# EasyEDA Pro project easyeda_project.epro, schematic SingleAcquisition

## Sheets
1 Signal Conditioning: Board Name: Acquisition; Create Date: 2024-08-09; Page Name: Signal Conditioning; Project Name: Thermal Flow Acquisition; Schematic Name: SingleAcquisition; Update Date: 2025-02-12; Company: EasyEDA.com; Drawn: EasyEDA; Page Size: A4; Part Number: JLCPCB-002; Reviewed: EasyEDA; Version: V0.1
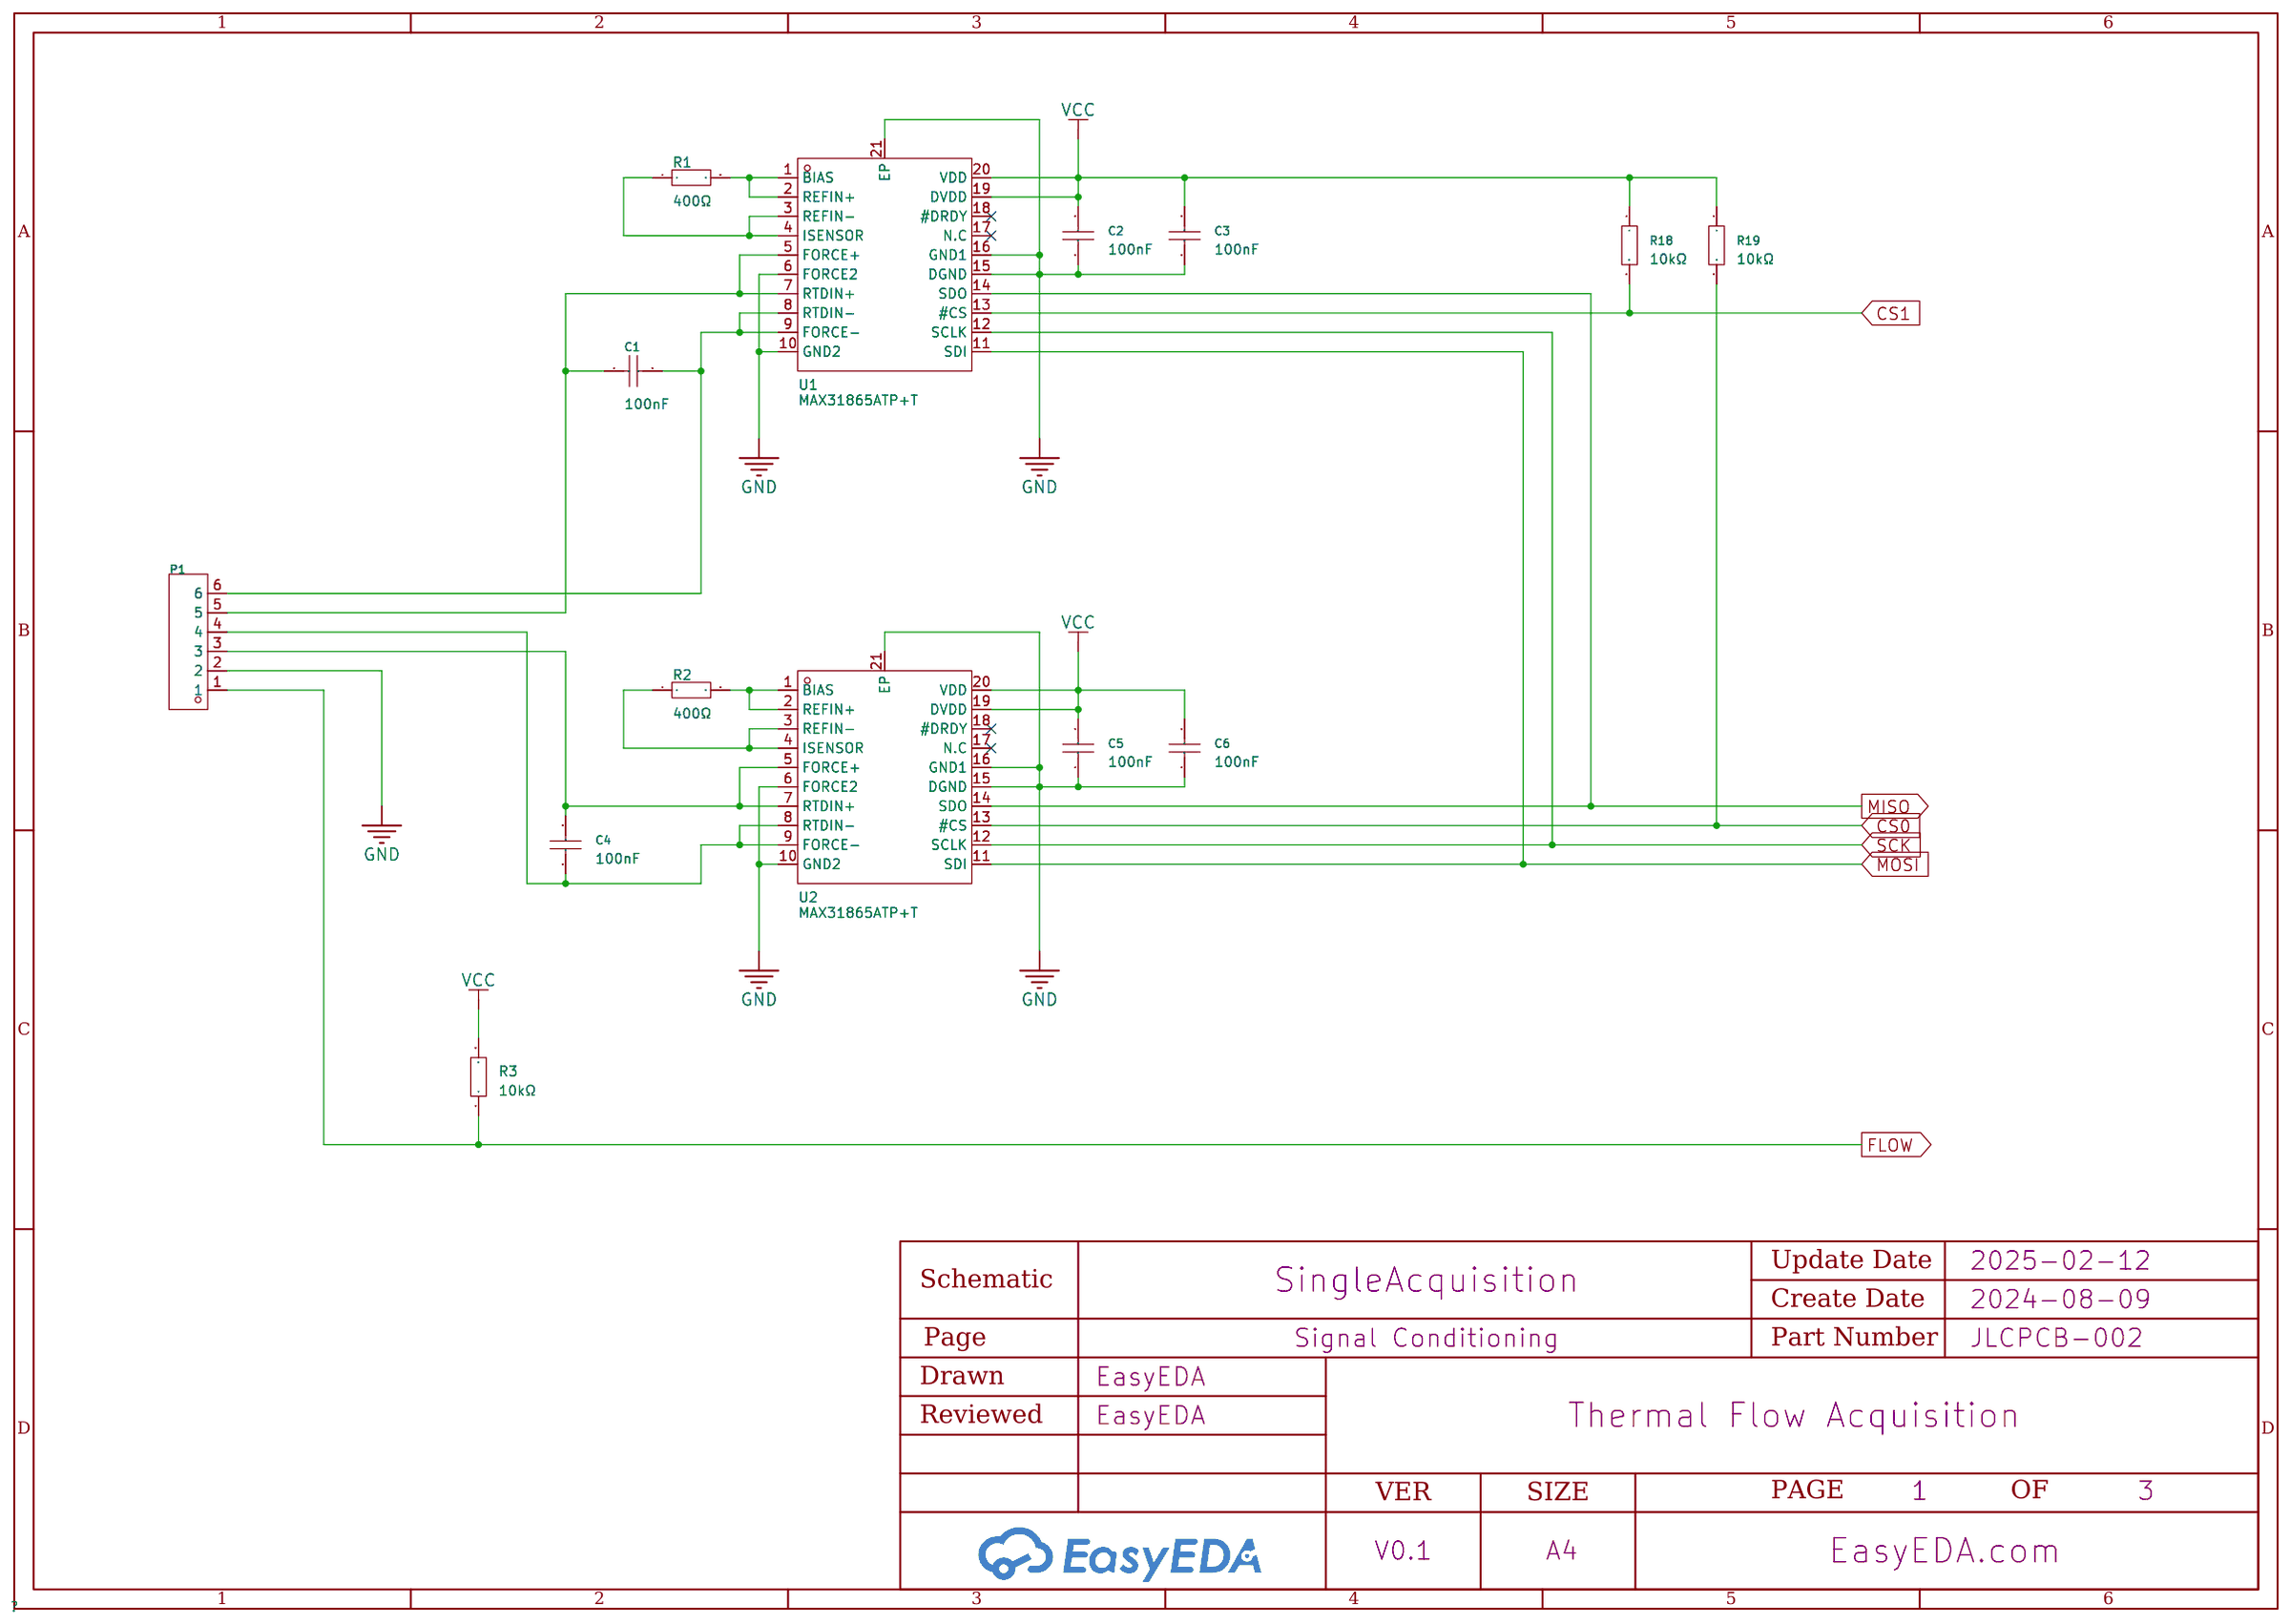
[diagram p0: Signal Conditioning]
2 MCU: Page Name: MCU; Update Date: 2025-03-19
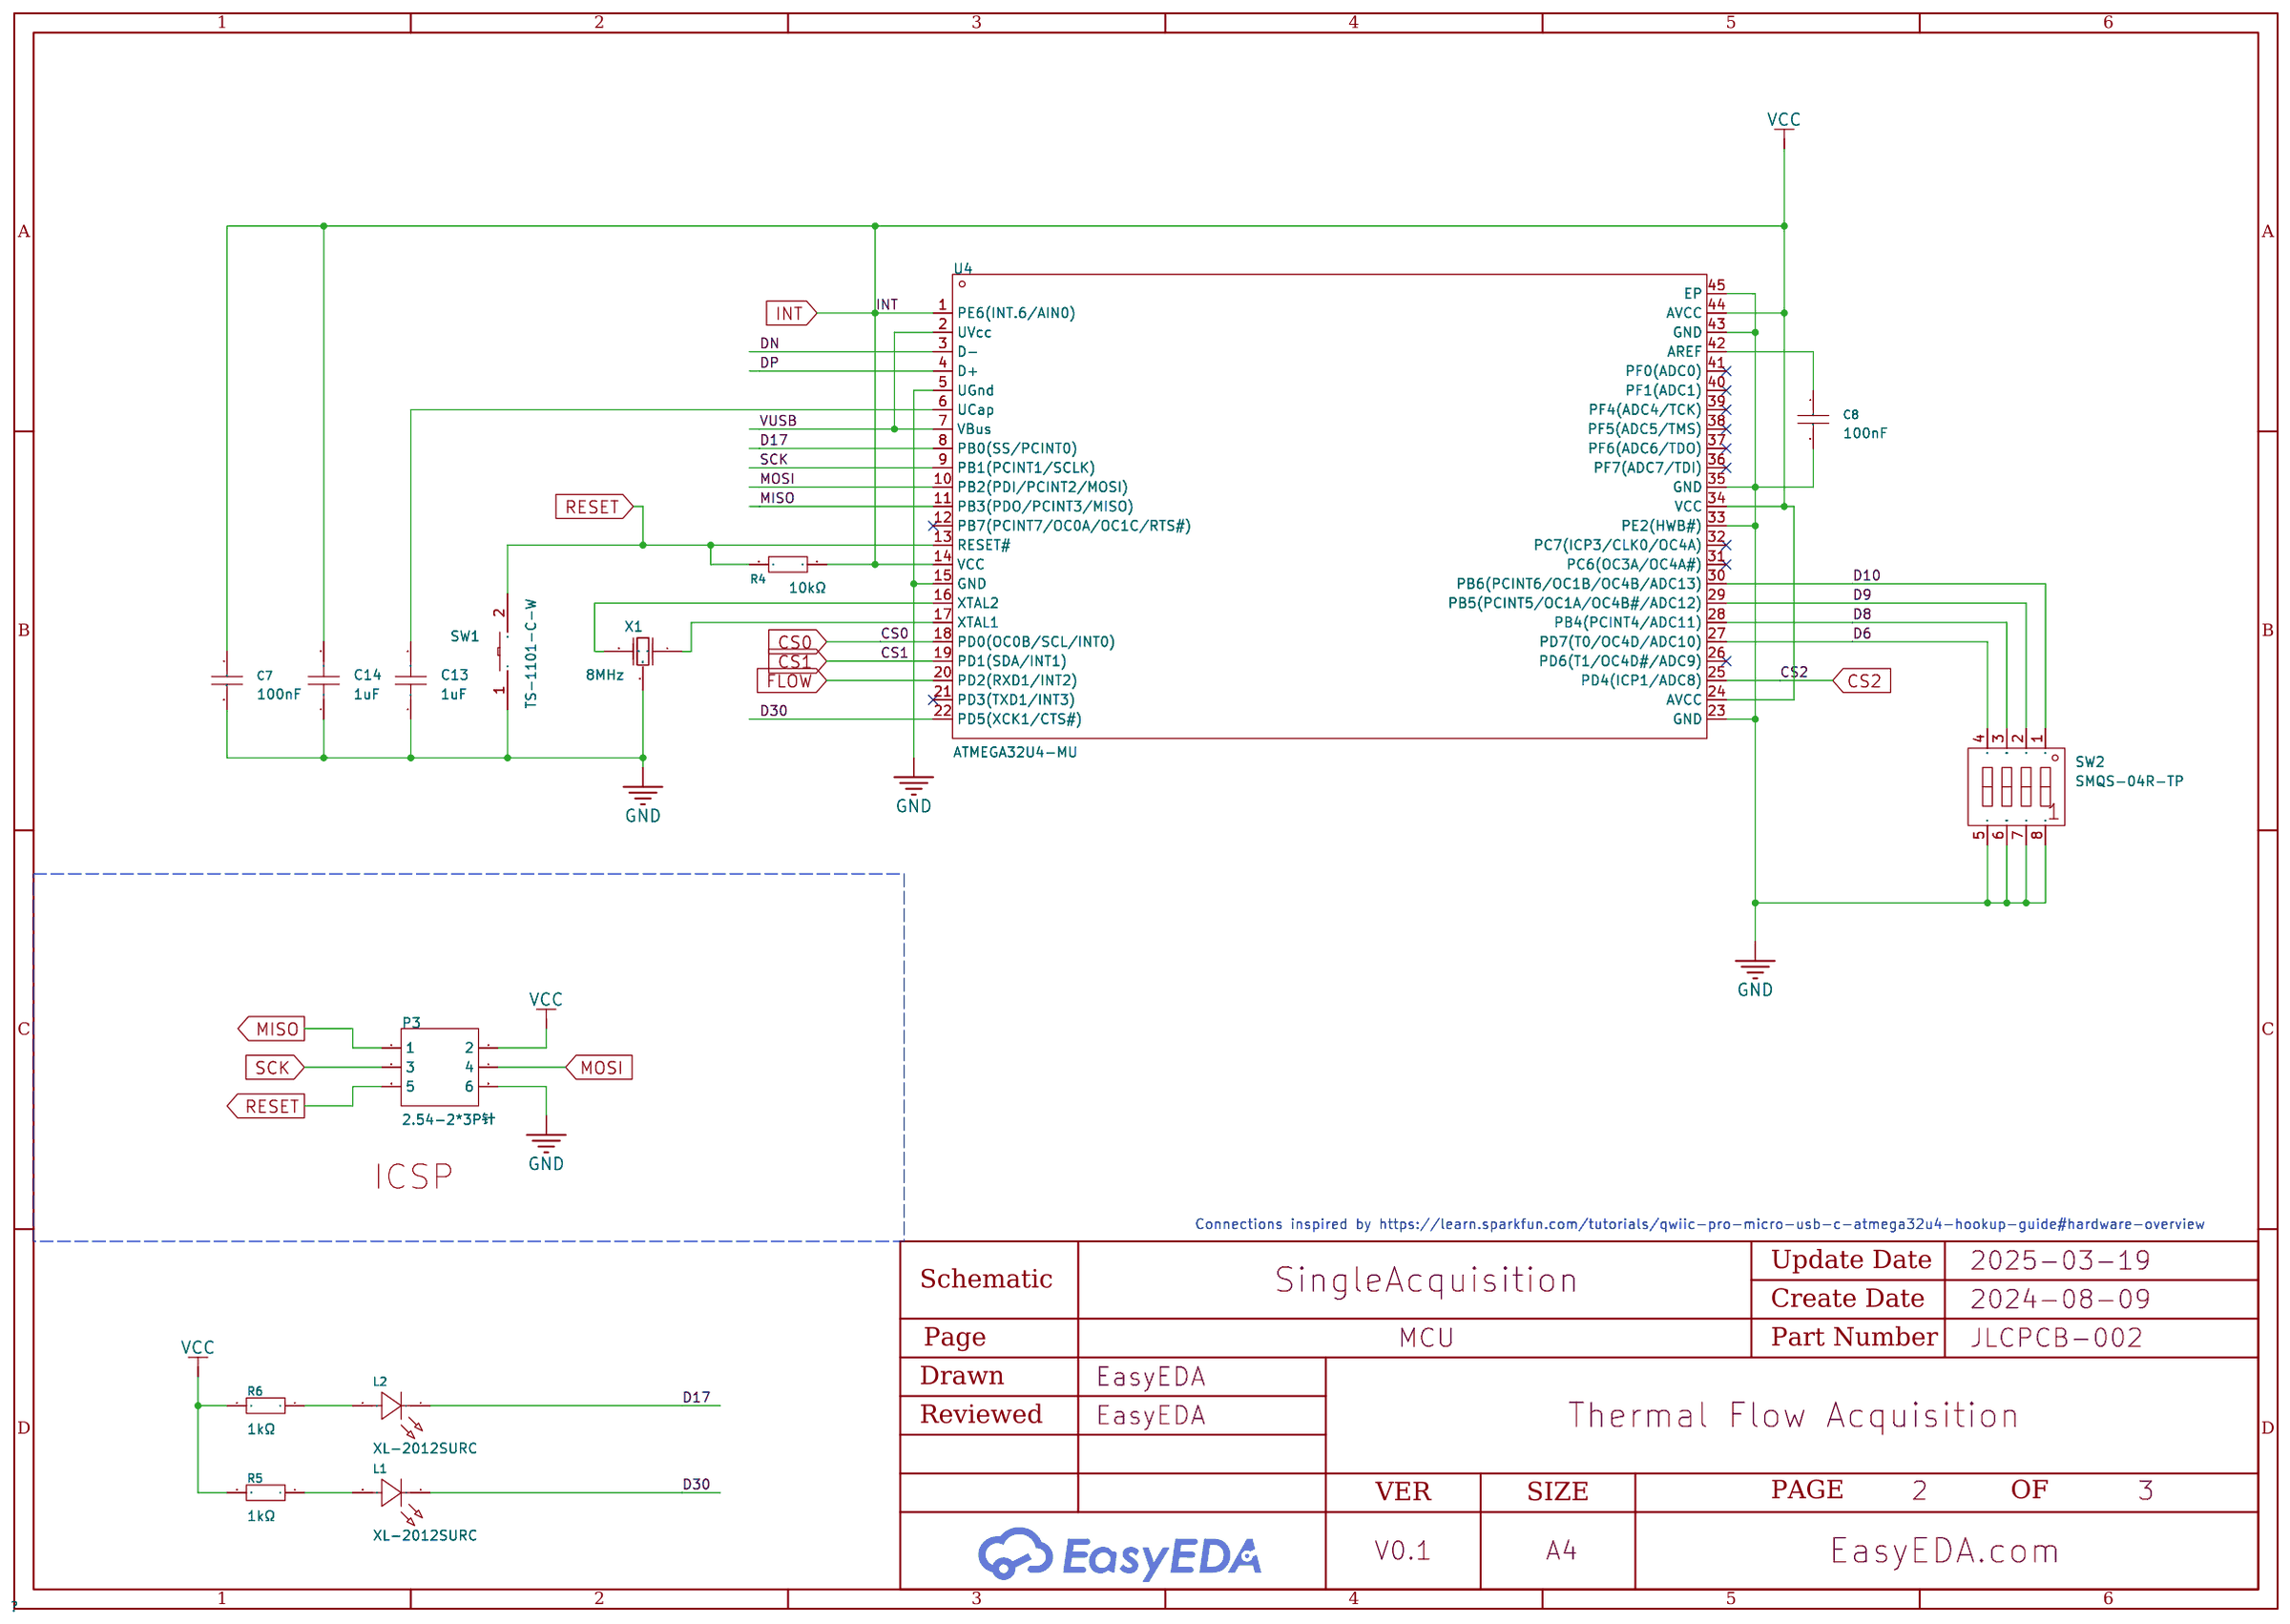
[diagram p1: MCU]
3 P4: Create Date: 2024-08-12; Page Name: P4
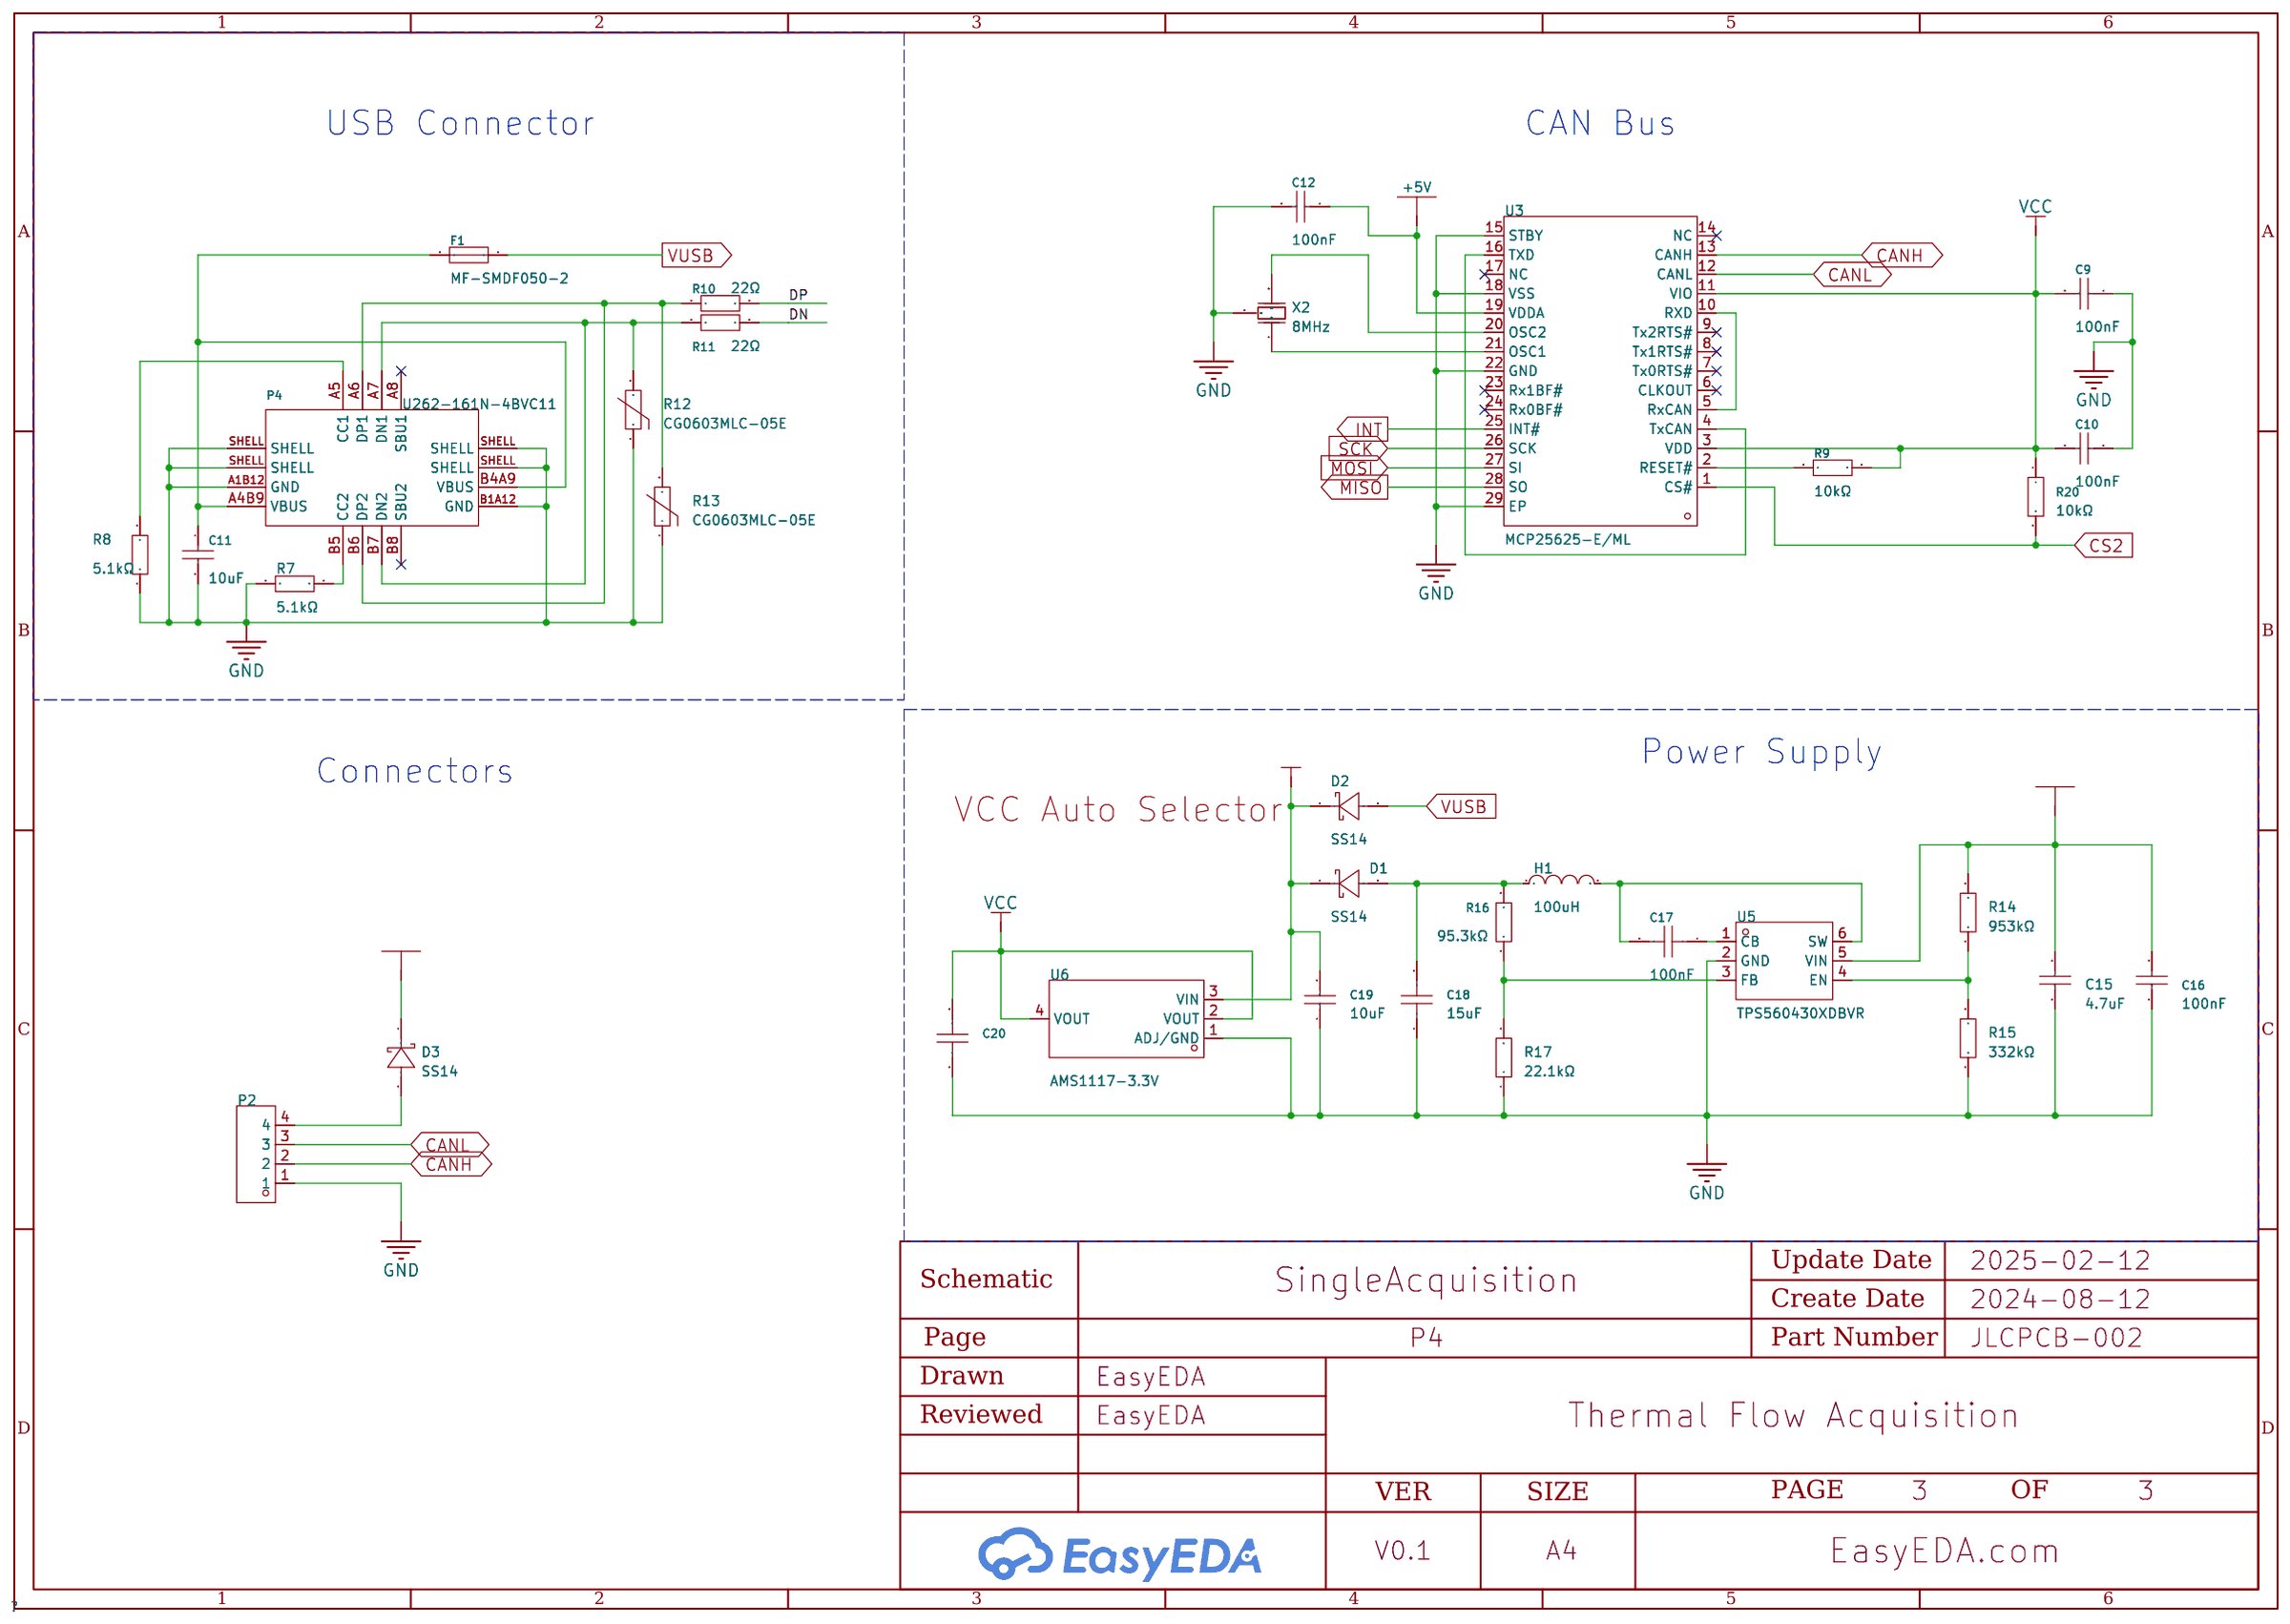
[diagram p2: P4]

## Parts
sheet MCU
C7  100nF  [C0805]
C8  100nF  [C0805]
C13  1uF  [C0805]
C14  1uF  [C0805]
L1  XL-2012SURC  [LED0805-RD_RED]
L2  XL-2012SURC  [LED0805-RD_RED]
P3  2.54-2*3P针  [HDR-TH_6P-P2.54-V-M-R2-C3-S2.54-1]
R4  10kΩ  [R0805]
R5  1kΩ  [R0805]
R6  1kΩ  [R0805]
SW1  TS-1101-C-W  [SW-SMD_L6.0-W3.3-LS8.0]
SW2  SMQS-04R-TP  [SW-TH_8P-P2.54_SMQS-04R-TP]
U4  ATMEGA32U4-MU  [VQFN-44_L7.0-W7.0-P0.50-BL-EP5.2]
X1  8MHz  [OSC-SMD_3P-L3.2-W1.3-P1.20-L]
sheet P4
C9  100nF  [C0805]
C10  100nF  [C0805]
C11  10uF  [C0805]
C12  100nF  [C0805]
C15  4.7uF  [C0805]
C16  100nF  [C0805]
C17  100nF  [C0805]
C18  15uF  [C1210]
C19  10uF  [C0805]
C20  22uF  [C0805]
D1  SS14  [SMA_L4.3-W2.6-LS5.1-RD]
D2  SS14  [SMA_L4.3-W2.6-LS5.1-RD]
D3  SS14  [SMA_L4.3-W2.6-LS5.1-RD]
F1  MF-SMDF050-2  [F2018]
H1  100uH  [IND-SMD_L3.5-W3.0_SLF0302]
P2  MX128-5.0-04P-GN01-Cu-Y-A  [CONN-TH_4P-MX128-5.0-04P-GN01-CU-Y-A]
P4  U262-161N-4BVC11  [USB-3.1-SMD_U262-161N-4BVC11]
R7  5.1kΩ  [R0805]
R8  5.1kΩ  [R0805]
R9  10kΩ  [R0805]
R10  22Ω  [R0805]
R11  22Ω  [R0805]
R12  CG0603MLC-05E  [R0603]
R13  CG0603MLC-05E  [R0603]
R14  953kΩ  [R0805]
R15  332kΩ  [R0805]
R16  95.3kΩ  [R0805]
R17  22.1kΩ  [R0805]
R20  10kΩ  [R0805]
U3  MCP25625-E/ML  [QFN-28_L6.0-W6.0-P0.65-BL-EP]
U5  TPS560430XDBVR  [SOT-23-6_L2.9-W1.6-P0.95-LS2.8-BL]
U6  AMS1117-3.3V  [SOT-223-4_L6.5-W3.5-P2.30-LS7.0-TR]
X2  8MHz  [OSC-SMD_3P-L3.2-W1.3-P1.20-L]
sheet Signal Conditioning
C1  100nF  [C0805]
C2  100nF  [C0805]
C3  100nF  [C0805]
C4  100nF  [C0805]
C5  100nF  [C0805]
C6  100nF  [C0805]
P1  MX128-5.0-06P-GN01-Cu-Y-A  [CONN-TH_6P-P5.00_MX128-5.0-06P-GN01-CU-Y-A]
R1  400Ω  [R0805]
R2  400Ω  [R0805]
R3  10kΩ  [R0805]
R18  10kΩ  [R0805]
R19  10kΩ  [R0805]
U1  MAX31865ATP+T  [QFN-20_L5.0-W5.0-P0.65-BL-EP]
U2  MAX31865ATP+T  [QFN-20_L5.0-W5.0-P0.65-BL-EP]

## Library data of the parts
C1-C10 C12 C16 = 0805B104K500NT: Capacitance:100nF Tolerance:±10% Tolerance:±10% Voltage Rated: Temperature Coefficient:; LCSC Part Name: 100nF ±10% 50V; Supplier Part: C38141; Manufacturer: FH(风华); Supplier Footprint: 0805; JLCPCB Part Class: Extended Part; Datasheet: https://atta.szlcsc.com/upload/public/pdf/source/20200305/C486355_26A10D38EF8C2A5C37091D0039909270.pdf; Supplier: LCSC; Tolerance: ±10%; Check: true
C13 C14 = 0805B105K500NT_C215803: Capacitance:1uF Tolerance:±10% Tolerance:±10% Voltage Rated: Temperature Coefficient:; LCSC Part Name: 1uF ±10% 50V; Supplier Part: C215803; Manufacturer: FH(风华); Manufacturer Part: 0805B105K500NT; Supplier Footprint: 0805; JLCPCB Part Class: Extended Part; Datasheet: https://atta.szlcsc.com/upload/public/pdf/source/20180530/C215803_D57791C2287FC18831C4E0C7838E6BEC.pdf; Supplier: LCSC; Tolerance: ±10%; Check: true
L1 L2 = XL-2012SURC: Emitted Color:Red Power Dissipation:55mW Forward Current:25mA Dominant Wavelength:617nm~621nm Dominant Wavelength:617nm~621nm Peak Wavelength:623nm Lens Color:无色透明透镜 Color Temperature:- Color Temperature:- Viewing Angle:120° Mounting Sytle:Positive post O; Supplier Part: C965812; Manufacturer: XINGLIGHT(成兴光); Supplier Footprint: 0805; JLCPCB Part Class: Extended Part; Datasheet: https://atta.szlcsc.com/upload/public/pdf/source/20221102/49E1A0A365644091E6270AF1C5E0FE37.pdf; Supplier: LCSC; Emitted Color: Red; Power Dissipation: 55mW; Forward Current: 25mA; Dominant Wavelength: 617nm~621nm; Peak Wavelength: 623nm; Lens Color: 无色透明透镜; Viewing Angle: 120°; Mounting Sytle: Positive post; Operating Temperature: -30℃~+85℃; Check: true
P3 = 2.54-2*3P针: Pin Structure:- Pitch:2.54mm Row Spacing:- Circluar Pins/Square Pins:- Mounting Type:Straight Number of Rows:双排 Number of Pins:6P Current Rating (Max):- Voltage Rating (Max):- Length of Mating Pin:- Insulation Height:- Contact Material: Contact Plating:-; LCSC Part Name: 间距:2.54mm 直插; Supplier Part: C65114; Manufacturer: BOOMELE(博穆精密); Supplier Footprint: 插件,P=2.54mm; JLCPCB Part Class: Extended Part; Supplier: LCSC; Pitch: 2.54mm; Mounting Type: Straight; Number of Rows: 双排; Number of Pins: 6P; Color: Black; Check: true
R4 R9 R18-R20 = 0805W8F1002T5E: Type:Thick Film Resistors Resistance:10kΩ Tolerance:±1% Tolerance:±1% Power(Watts): Overload Voltage (Max): Temperature Coefficient:±100ppm/℃ Temperature Coefficient:±100ppm/℃ Operating Temperature Range:-55℃~+155℃ Operating Temperature Range:-55℃~+155℃; LCSC Part Name: 10kΩ ±1% 125mW 厚膜电阻; Supplier Part: C17414; Manufacturer: UNI-ROYAL(厚声); Supplier Footprint: 0805; JLCPCB Part Class: Basic Part; Datasheet: https://atta.szlcsc.com/upload/public/pdf/source/20200306/C422600_1E6D84923E4A46A82E41ADD87F860B5C.pdf; Supplier: LCSC; Type: Thick Film Resistors; Tolerance: ±1%; Temperature Coefficient: ±100ppm/℃; Operating Temperature Range: -55℃~+155℃; Check: true
R5 R6 = 0805W8F1001T5E: Type:Thick Film Resistors Resistance:1kΩ Tolerance:±1% Tolerance:±1% Power(Watts): Overload Voltage (Max): Temperature Coefficient:±100ppm/℃ Temperature Coefficient:±100ppm/℃ Operating Temperature Range:-55℃~+155℃ Operating Temperature Range:-55℃~+155℃; LCSC Part Name: 1kΩ ±1% 125mW 厚膜电阻; Supplier Part: C17513; Manufacturer: UNI-ROYAL(厚声); Supplier Footprint: 0805; JLCPCB Part Class: Basic Part; Datasheet: https://atta.szlcsc.com/upload/public/pdf/source/20200306/C422600_1E6D84923E4A46A82E41ADD87F860B5C.pdf; Supplier: LCSC; Type: Thick Film Resistors; Tolerance: ±1%; Temperature Coefficient: ±100ppm/℃; Operating Temperature Range: -55℃~+155℃; Check: true
SW1 = TS-1101-C-W: Circuit:SPST Actuator Style:Rectangle button Operating Force:260gf Mounting Style:Brick nogging Switch Length:6mm Switch Width:3.6mm Switch Height:2.5mm Strike Gundam:不带 Contact Current:50mA Voltage Rating (AC):- Voltage Rating (DC):12V Power Rating:- Ins; LCSC Part Name: 6*3.6*2.5mm 立贴 轻触开关; Supplier Part: C318938; Manufacturer: XKB Connectivity(中国星坤); Supplier Footprint: SMD; JLCPCB Part Class: Extended Part; Datasheet: https://atta.szlcsc.com/upload/public/pdf/source/20200227/C318938_C2E53B1EEDE37D980A33616AC086DE53.pdf; Supplier: LCSC; Circuit: SPST; Actuator Style: Rectangle button; Operating Force: 260gf; Mounting Style: Brick nogging; Switch Length: 6mm; Switch Width: 3.6mm; Switch Height: 2.5mm; Strike Gundam: 不带; Contact Current: 50mA; Voltage Rating (DC): 12V; Actuator/Cap Color: 白色带淡绿; With Lamp: No; Mechanical Life: 5万次; Operating Temperature: -30℃~+85℃; Check: true
SW2 = SMQS-04R-TP: Type:平拨,凸起式 Circuit:- Number of Positions:4Bit Pin Style:- Lead Pitch:2.54mm Current Rating:- Voltage Rating:- Operating Temperature:-40℃~+85℃ Operating Temperature:-40℃~+85℃ Operating Life:5千次 Color:Red; LCSC Part Name: 间距2.54mm 平拨,凸起式4位拨码开关; Supplier Part: C5299505; Manufacturer: SM Switch; JLCPCB Part Class: Extended Part; Datasheet: https://atta.szlcsc.com/upload/public/pdf/source/20230428/BECBF613F67C0CF733CC6E01F0CA4E67.pdf; Supplier: LCSC; Type: 平拨,凸起式; Number of Positions: 4Bit; Lead Pitch: 2.54mm; Operating Temperature: -40℃~+85℃; Operating Life: 5千次; Color: Red; Check: true
U4 = ATMEGA32U4-MU: CPU Core:AVR Program Storage Size:32KB RAM Size:2.5KB GPIO Ports Number:26 Operating Voltage Range:2.7V~5.5V Operating Voltage Range:2.7V~5.5V CPU Maximum Speed:16MHz Program Memory Type:FLASH EEPROM:1KB Operating Temperature Range:-40℃~+85℃ Operating Tem; Supplier Part: C112161; Manufacturer: MICROCHIP(美国微芯); Supplier Footprint: VQFN-44-EP(7x7); JLCPCB Part Class: Extended Part; Datasheet: https://atta.szlcsc.com/upload/public/pdf/source/20170515/1494827289828.pdf; Supplier: LCSC; CPU Core: AVR; Program Storage Size: 32KB; RAM Size: 2.5KB; GPIO Ports Number: 26; Operating Voltage Range: 2.7V~5.5V; CPU Maximum Speed: 16MHz; Program Memory Type: FLASH; EEPROM: 1KB; Operating Temperature Range: -40℃~+85℃; ADC (Bit): 10bit; Universal Serial Bus: 有; Peripheral/Function: WDT；PWM；WDT；PWM; Watchdog: 有; Low-Voltage Detect: 有; Internal Oscillator: 有; Check: true
X1 X2 = CSTNE8M00GH5C000R0: Frequency: Built-in Load Capacitance: Resonant Impedance: Operating Temperature:-40℃~+125℃ Operating Temperature:-40℃~+125℃; LCSC Part Name: 8MHz ±0.07% 内置负载电容:33pF; Supplier Part: C341525; Manufacturer: muRata(村田); Supplier Footprint: SMD3213-3P; JLCPCB Part Class: Extended Part; Datasheet: https://atta.szlcsc.com/upload/public/pdf/source/20181211/C341525_832BA077079E4863A5153C1DB98581D5.pdf; Supplier: LCSC; Operating Temperature: -40℃~+125℃; Crystal Type: 贴片晶振; Normal temperature Frequency Tolerance: ±20ppm; Frequency Stability(Full temperature range): ±30ppm; Check: true
C11 C19 = CL21A106KOQNNNE: Capacitance: Tolerance:±10% Tolerance:±10% Voltage Rated: Temperature Coefficient:; LCSC Part Name: 10uF ±10% 16V; Supplier Part: C1713; Manufacturer: SAMSUNG(三星); Supplier Footprint: 0805; JLCPCB Part Class: Extended Part; Datasheet: https://atta.szlcsc.com/upload/public/pdf/source/20160218/1457707763339.pdf; Supplier: LCSC; Tolerance: ±10%; Check: true
C15 = CL21A475KAQNNNE: Capacitance: Tolerance:±10% Tolerance:±10% Voltage Rated: Temperature Coefficient:; LCSC Part Name: 4.7uF ±10% 25V; Supplier Part: C1779; Manufacturer: SAMSUNG(三星); Supplier Footprint: 0805; JLCPCB Part Class: Basic Part; Datasheet: https://atta.szlcsc.com/upload/public/pdf/source/20160218/1457707763339.pdf; Supplier: LCSC; Tolerance: ±10%; Check: true
C17 = 0805B104K500NT: Capacitance:100nF Tolerance:±10% Tolerance:±10% Voltage Rated: Temperature Coefficient:; LCSC Part Name: 100nF ±10% 50V; Supplier Part: C38141; Manufacturer: FH(风华); Supplier Footprint: 0805; JLCPCB Part Class: Extended Part; Datasheet: https://atta.szlcsc.com/upload/public/pdf/source/20200305/C486355_26A10D38EF8C2A5C37091D0039909270.pdf; Supplier: LCSC; Tolerance: ±10%
C18 = C3225X7R1C156MT000N: Capacitance: Tolerance:±20% Tolerance:±20% Voltage Rated: Temperature Coefficient:; LCSC Part Name: 15uF ±20% 16V; Supplier Part: C694469; Manufacturer: TDK; Supplier Footprint: 1210; JLCPCB Part Class: Extended Part; Datasheet: https://atta.szlcsc.com/upload/public/pdf/source/20191008/C432930_1569A900251E35B50161EFC1E9A1C511.pdf; Supplier: LCSC; Tolerance: ±20%; Check: true
C20 = CL21A226MQQNNNE: Capacitance: Tolerance:±20% Tolerance:±20% Voltage Rated: Temperature Coefficient:; LCSC Part Name: 22uF ±20% 6.3V; Supplier Part: C5674; Manufacturer: SAMSUNG(三星); Supplier Footprint: 0805; JLCPCB Part Class: Extended Part; Datasheet: https://atta.szlcsc.com/upload/public/pdf/source/20160218/1457707763339.pdf; Supplier: LCSC; Tolerance: ±20%; Check: true
D1-D3 = SS14_C2986110: Diode Configuration:Independent Type Forward Voltage (Vf@If):550mV@1A Reverse Voltage (Vr):40V Rectified Current:1A Reverse Leakage Current (Ir):200uA; LCSC Part Name: 电压:40V 电流:1A; Supplier Part: C2986110; Manufacturer: GOODWORK(固得沃克); Supplier Footprint: SMA(DO-214AC); JLCPCB Part Class: Extended Part; Datasheet: https://atta.szlcsc.com/upload/public/pdf/source/20240611/0F76773D64B262C18F3BFBB7F399B933.pdf; Supplier: LCSC; Diode Configuration: Independent Type; Forward Voltage (Vf@If): 550mV@1A; Reverse Voltage (Vr): 40V; Rectified Current: 1A; Reverse Leakage Current (Ir): 200uA; Check: true
F1 = MF-SMDF050-2: Operating Voltage (Max):60V Current Rating (Max):10A Hold Current:550mA Trip Current:1.2A Resistance - Initial (Ri) (Min):200mΩ Maximum Time to Trip:3s Operating Temperature:-40℃~+85℃；-40℃~+85℃；-40℃~+85℃ Operating Temperature:-40℃~+85℃；-40℃~+85℃；-40℃~+85℃; LCSC Part Name: 60V 550mA 2018自恢复; Supplier Part: C210839; Manufacturer: BOURNS; Supplier Footprint: 2018; JLCPCB Part Class: Extended Part; Datasheet: https://atta.szlcsc.com/upload/public/pdf/source/20180524/C210839_0A0D8821181D0C9E183F80E05E09842A.pdf; Supplier: LCSC; Operating Voltage (Max): 60V; Current Rating (Max): 10A; Hold Current: 550mA; Trip Current: 1.2A; Resistance - Initial (Ri) (Min): 200mΩ; Maximum Time to Trip: 3s; Operating Temperature: -40℃~+85℃；-40℃~+85℃；-40℃~+85℃; Check: true
H1 = CD32YP0302-101M: Inductance: Tolerance:±20% Tolerance:±20% Rated Current: DC Resistance (DCR):; LCSC Part Name: 100uH ±20%; Supplier Part: C492265; Manufacturer: YJYCOIN(益嘉源); Supplier Footprint: SMD,3.5x3x2.1mm; JLCPCB Part Class: Extended Part; Datasheet: https://atta.szlcsc.com/upload/public/pdf/source/20200311/C492266_3C4DCA97B8B94D4CA8DBD234C7C1D8A4.pdf; Supplier: LCSC; Tolerance: ±20%; Check: true
P2 = MX128-5.0-04P-GN01-Cu-Y-A: Structure:1x4P Pitch:5mm Color:Green Mounting Style:Direct Insert Number of Pins:4P Number of Rows:1 Number of PINs Per Row:4 Screw Specification:M2.5 Current Rating (Max):10A Voltage Rating (Max):300V Wire Gauge - AWG:12~24 Wire Gauge - AWG:12~24 Operati; LCSC Part Name: 1x4P 5mm 直插 排数:1 每排P数:4; Supplier Part: C5290369; Manufacturer: MAX(迈旭); Supplier Footprint: 插件,P=5mm; JLCPCB Part Class: Extended Part; Datasheet: https://atta.szlcsc.com/upload/public/pdf/source/20230914/7C59C50CB6A87747FF89F939B009DABF.pdf; Supplier: LCSC; Structure: 1x4P; Pitch: 5mm; Color: Green; Mounting Style: Direct Insert; Number of Pins: 4P; Number of Rows: 1; Number of PINs Per Row: 4; Screw Specification: M2.5; Current Rating (Max): 10A; Voltage Rating (Max): 300V; Wire Gauge - AWG: 12~24; Operating Temperature Range: -40℃~+105℃
P4 = U262-161N-4BVC11: Connector Type:Type-C Standard:USB 3.1 Gender:Female Number of Ports:1 Number of Contacts:16P Mounting Style:卧贴 Current Rating - Power (Max):3A Contact Material:Copper Alloy Contact Plating:Gold Operating Temperature Range:-40℃~+85℃ Operating Temperature; LCSC Part Name: Type-C 母 卧贴; Supplier Part: C319148; Manufacturer: XKB Connectivity(中国星坤); Supplier Footprint: SMD; JLCPCB Part Class: Extended Part; Datasheet: https://atta.szlcsc.com/upload/public/pdf/source/20211015/B478CBA0F1623DA36A6CC6918C49C838.pdf; Supplier: LCSC; Connector Type: Type-C; Standard: USB 3.1; Gender: Female; Number of Ports: 1; Number of Contacts: 16P; Mounting Style: 卧贴; Current Rating - Power (Max): 3A; Contact Material: Copper Alloy; Contact Plating: Gold; Operating Temperature Range: -40℃~+85℃; Soldering Temperature(Max): 260℃; Check: true
R7 R8 = RMC08055.1K5%N: Resistance: Tolerance:±5% Tolerance:±5% Power(Watts):; LCSC Part Name: 5.1kΩ ±5% 125mW; Supplier Part: C269736; Manufacturer: Tyohm(幸亚电阻); Supplier Footprint: 0805; JLCPCB Part Class: Extended Part; Datasheet: https://atta.szlcsc.com/upload/public/pdf/source/20190115/C325956_D27151D492FFB3C9AB4A6F14FE01F30A.pdf; Supplier: LCSC; Tolerance: ±5%; Check: true
R10 R11 = 0805W8F220JT5E: Type:Thick Film Resistors Resistance:22Ω Tolerance:±1% Tolerance:±1% Power(Watts): Overload Voltage (Max): Temperature Coefficient:±100ppm/℃ Temperature Coefficient:±100ppm/℃ Operating Temperature Range:-55℃~+155℃ Operating Temperature Range:-55℃~+155℃; LCSC Part Name: 22Ω ±1% 125mW 厚膜电阻; Supplier Part: C17561; Manufacturer: UNI-ROYAL(厚声); Supplier Footprint: 0805; JLCPCB Part Class: Basic Part; Datasheet: https://atta.szlcsc.com/upload/public/pdf/source/20200306/C422600_1E6D84923E4A46A82E41ADD87F860B5C.pdf; Supplier: LCSC; Type: Thick Film Resistors; Tolerance: ±1%; Temperature Coefficient: ±100ppm/℃; Operating Temperature Range: -55℃~+155℃; Check: true
R12 R13 = CG0603MLC-05E: Varistor Voltage:- Varistor Voltage:- Clamping Voltage: Allowable Voltage (DC): Allowable Voltage (AC):- Peak Current:- Maximum Energy:- Maximum Energy:- Typical Capatitance:0.5pF@1MHz Rated Wattage:-; LCSC Part Name: 钳位电压30V 0603压敏电阻; Supplier Part: C840634; Manufacturer: BOURNS; Supplier Footprint: 0603; JLCPCB Part Class: Extended Part; Datasheet: https://atta.szlcsc.com/upload/public/pdf/source/20201223/C840634_B51E4581574E60DB347F1EECC1FE1523.pdf; Supplier: LCSC; Typical Capatitance: 0.5pF@1MHz; Check: true
R14 = CR0805F89533G: Type:Thick Film Resistors Resistance: Tolerance:±1% Tolerance:±1% Power(Watts): Overload Voltage (Max): Temperature Coefficient:±100ppm/℃ Temperature Coefficient:±100ppm/℃ Operating Temperature Range:-55℃~+125℃ Operating Temperature Range:-55℃~+125℃; LCSC Part Name: 厚膜电阻 953kΩ ±1% 125mW; Supplier Part: C101915; Manufacturer: LIZ(丽智电子); Supplier Footprint: 0805; JLCPCB Part Class: Extended Part; Datasheet: https://atta.szlcsc.com/upload/public/pdf/source/20180403/C189438_6D658388CC7843F35BBC9018D03F0B8E.pdf; Supplier: LCSC; Type: Thick Film Resistors; Tolerance: ±1%; Temperature Coefficient: ±100ppm/℃; Operating Temperature Range: -55℃~+125℃
R15 = AC0805FR-07332KL: Type:Thick Film Resistors Resistance: Tolerance:±1% Tolerance:±1% Power(Watts): Overload Voltage (Max): Temperature Coefficient:±100ppm/℃ Temperature Coefficient:±100ppm/℃ Operating Temperature Range:-55℃~+155℃ Operating Temperature Range:-55℃~+155℃; LCSC Part Name: 厚膜电阻 332kΩ ±1% 125mW; Supplier Part: C228750; Manufacturer: YAGEO(国巨); Supplier Footprint: 0805; JLCPCB Part Class: Extended Part; Datasheet: https://atta.szlcsc.com/upload/public/pdf/source/20180927/C229861_4ABDC471507C1ED6AFB4BA66AFC8620A.pdf; Supplier: LCSC; Type: Thick Film Resistors; Tolerance: ±1%; Temperature Coefficient: ±100ppm/℃; Operating Temperature Range: -55℃~+155℃; Check: true
R16 = 0805W8F9532T5E: Type:Thick Film Resistors Resistance:95.3kΩ Tolerance:±1% Tolerance:±1% Power(Watts): Overload Voltage (Max): Temperature Coefficient:±100ppm/℃ Temperature Coefficient:±100ppm/℃ Operating Temperature Range:-55℃~+155℃ Operating Temperature Range:-55℃~+155℃; LCSC Part Name: 95.3kΩ ±1% 125mW 厚膜电阻; Supplier Part: C17873; Manufacturer: UNI-ROYAL(厚声); Supplier Footprint: 0805; JLCPCB Part Class: Extended Part; Datasheet: https://atta.szlcsc.com/upload/public/pdf/source/20200306/C422600_1E6D84923E4A46A82E41ADD87F860B5C.pdf; Supplier: LCSC; Type: Thick Film Resistors; Tolerance: ±1%; Temperature Coefficient: ±100ppm/℃; Operating Temperature Range: -55℃~+155℃; Check: true
R17 = CR0805-FX-2212ELF: Type:Thick Film Resistors Resistance: Tolerance:±1% Tolerance:±1% Power(Watts): Temperature Coefficient:±100ppm/℃ Temperature Coefficient:±100ppm/℃ Operating Temperature Range:-55℃~+155℃ Operating Temperature Range:-55℃~+155℃; LCSC Part Name: 厚膜电阻 22.1kΩ ±1% 125mW; Supplier Part: C204311; Manufacturer: BOURNS; Supplier Footprint: 0805; JLCPCB Part Class: Extended Part; Datasheet: https://atta.szlcsc.com/upload/public/pdf/source/20181212/C205087_1ACD03E1A16EE5293BD8A283223FEE72.pdf; Supplier: LCSC; Type: Thick Film Resistors; Tolerance: ±1%; Temperature Coefficient: ±100ppm/℃; Operating Temperature Range: -55℃~+155℃; Check: true
U3 = MCP25625-E/ML: Type:Transceiver Supply Voltage:2.7V~5.5V Supply Voltage:2.7V~5.5V Operating Temperature:-40℃~+125℃ Operating Temperature:-40℃~+125℃; Supplier Part: C481365; Manufacturer: MICROCHIP(美国微芯); Supplier Footprint: QFN-28-EP(6x6); JLCPCB Part Class: Extended Part; Datasheet: https://atta.szlcsc.com/upload/public/pdf/source/20201223/C628816_5D7244704F0FAE2BF70B082B7A383B59.pdf; Supplier: LCSC; Type: Transceiver; Supply Voltage: 2.7V~5.5V; Operating Temperature: -40℃~+125℃; Check: true
U5 = TPS560430XDBVR: Function:Step-down type Output Type:- Input Voltage:4V~36V Input Voltage:4V~36V Output Voltage:1V~34.2V Output Voltage:1V~34.2V Output Current (Max):600mA Switching Frequency:1.1MHz Operating Temperature:-40℃~+125℃@(TJ) Operating Temperature:-40℃~+125℃@(T; Supplier Part: C524782; Manufacturer: TI(德州仪器); Supplier Footprint: SOT-23-6; JLCPCB Part Class: Extended Part; Datasheet: https://www.ti.com/cn/lit/gpn/tps560430; Supplier: LCSC; Function: Step-down type; Input Voltage: 4V~36V; Output Voltage: 1V~34.2V; Output Current (Max): 600mA; Switching Frequency: 1.1MHz; Operating Temperature: -40℃~+125℃@(TJ); Synchronous Rectification: Yes; Number of Outputs: 1; Topology: Step-down; Switch tube (built-in/external): 内置; Check: true
U6 = AMS1117-3.3V_C5120765: Output Type: Maximum Input Voltage:18V Output Voltage:3.3V Output Voltage:3.3V MAX Output Current:1A Dropout Voltage:1.4V@(1A) standby current:12mA Operating Temperature:0℃~+125℃ Operating Temperature:0℃~+125℃ Output Polarity:Positive electrode Number of; LCSC Part Name: 输入18V 输出3.3V 1A; Supplier Part: C5120765; Manufacturer: MSKSEMI(美森科); Supplier Footprint: SOT-223; JLCPCB Part Class: Extended Part; Datasheet: https://atta.szlcsc.com/upload/public/pdf/source/20230802/7000FCAFF33971783A269E7BD69EFE08.pdf; Supplier: LCSC; Maximum Input Voltage: 18V; Output Voltage: 3.3V; MAX Output Current: 1A; Dropout Voltage: 1.4V@(1A); standby current: 12mA; Operating Temperature: 0℃~+125℃; Output Polarity: Positive electrode; Number of Outputs: 1
P1 = MX128-5.0-06P-GN01-Cu-Y-A: Structure:1x6P Pitch:5mm Color:Green Mounting Style:Direct Insert Number of Pins:6P Number of Rows:1 Number of PINs Per Row:6 Screw Specification:M2.5 Current Rating (Max):10A Voltage Rating (Max):300V Wire Gauge - AWG:12~24 Wire Gauge - AWG:12~24 Operati; LCSC Part Name: 1x6P 5mm 直插 排数:1 每排P数:6; Supplier Part: C5290371; Manufacturer: MAX(迈旭); Supplier Footprint: 插件,P=5mm; JLCPCB Part Class: Extended Part; Datasheet: https://atta.szlcsc.com/upload/public/pdf/source/20230914/7C59C50CB6A87747FF89F939B009DABF.pdf; Supplier: LCSC; Structure: 1x6P; Pitch: 5mm; Color: Green; Mounting Style: Direct Insert; Number of Pins: 6P; Number of Rows: 1; Number of PINs Per Row: 6; Screw Specification: M2.5; Current Rating (Max): 10A; Voltage Rating (Max): 300V; Wire Gauge - AWG: 12~24; Operating Temperature Range: -40℃~+105℃; Wire Gauge - mm2: 2.5
R1 R2 = TR0805B400RP0525Z: Type:Thin Film Resistor Resistance: Tolerance:±0.1% Tolerance:±0.1% Power(Watts): Overload Voltage (Max): Temperature Coefficient:±25ppm/℃ Temperature Coefficient:±25ppm/℃ Operating Temperature Range:-55℃~+155℃ Operating Temperature Range:-55℃~+155℃; LCSC Part Name: 薄膜电阻 400Ω ±0.1% 125mW; Supplier Part: C153298; Manufacturer: EVER OHMS(天二科技); Supplier Footprint: 0805; JLCPCB Part Class: Extended Part; Datasheet: https://atta.szlcsc.com/upload/public/pdf/source/20190527/C149900_32B1354086E9F6A772108AB7B2B7A514.pdf; Supplier: LCSC; Type: Thin Film Resistor; Tolerance: ±0.1%; Temperature Coefficient: ±25ppm/℃; Operating Temperature Range: -55℃~+155℃; Check: true
R3 = 0805W8F1002T5E: Type:Thick Film Resistors Resistance:10kΩ Tolerance:±1% Tolerance:±1% Power(Watts): Overload Voltage (Max): Temperature Coefficient:±100ppm/℃ Temperature Coefficient:±100ppm/℃ Operating Temperature Range:-55℃~+155℃ Operating Temperature Range:-55℃~+155℃; LCSC Part Name: 10kΩ ±1% 125mW 厚膜电阻; Supplier Part: C17414; Manufacturer: UNI-ROYAL(厚声); Supplier Footprint: 0805; JLCPCB Part Class: Basic Part; Datasheet: https://atta.szlcsc.com/upload/public/pdf/source/20200306/C422600_1E6D84923E4A46A82E41ADD87F860B5C.pdf; Supplier: LCSC; Type: Thick Film Resistors; Tolerance: ±1%; Temperature Coefficient: ±100ppm/℃; Operating Temperature Range: -55℃~+155℃
U1 U2 = MAX31865ATP+T: Interface:SPI differential input:Yes number of channels:1 Supply Voltage:3V~3.6V Supply Voltage:3V~3.6V Integral nonlinearity:±1LSB Integral nonlinearity:±1LSB sampling frequency:- resolution:15 Operating Temperature:-40℃~+125℃ Operating Temperature:-40℃~; LCSC Part Name: MAX31865ATP; Supplier Part: C118474; Manufacturer: ADI(亚德诺)/MAXIM(美信); Supplier Footprint: QFN-20-EP(5x5); JLCPCB Part Class: Extended Part; Datasheet: https://atta.szlcsc.com/upload/public/pdf/source/20190723/C404011_F7F4B1E2DB54BAF2C7538ADE86C8BDC0.pdf; Supplier: LCSC; Check: true; Interface: SPI; differential input: Yes; number of channels: 1; Supply Voltage: 3V~3.6V; Integral nonlinearity: ±1LSB; resolution: 15; Operating Temperature: -40℃~+125℃

## Nets
+5V: C12.1 C19.2 D1.1(K) D2.1(K) U3.19(VDDA) U6.3(VIN)
+24V: C15.2 C16.2 D3.1(K) R14.2 U5.5(VIN)
GND: C2.1 C3.1 C5.1 C6.1 C7.2 C8.2 C9.1 C10.1 C11.2 C12.2 C13.1 C14.1 C15.1 C16.1 C18.1 C19.1 C20.1 P1.2 P2.1 P3.6 P4.A1B12(GND) P4.B1A12(GND) P4.SHELL R7.2 R8.1 R12.1 R13.1 R15.1 R17.1 SW1.1 SW2.5(PIN5) SW2.6(PIN6) SW2.7(PIN7) SW2.8(PIN8) U1.6(FORCE2) U1.10(GND2) U1.15(DGND) U1.16(GND1) U1.21(EP) U2.6(FORCE2) U2.10(GND2) U2.15(DGND) U2.16(GND1) U2.21(EP) U3.15(STBY) U3.18(VSS) U3.22(GND) U3.29(EP) U4.5(UGnd) U4.15(GND) U4.23(GND) U4.33(PE2(HWB#)) U4.35(GND) U4.43(GND) U4.45(EP) U5.2(GND) U6.1(ADJ/GND) X1.2(GND) X2.2(GND)
VCC: C2.2 C3.2 C5.2 C6.2 C7.1 C9.2 C10.2 C14.2 C20.2 P3.2 R3.2 R4.1 R5.2 R6.2 R9.1 R18.1 R19.1 R20.1 U1.19(DVDD) U1.20(VDD) U2.19(DVDD) U2.20(VDD) U3.3(VDD) U3.11(VIO) U4.14(VCC) U4.24(AVCC) U4.34(VCC) U4.44(AVCC) U6.2(VOUT) U6.4(VOUT)
CANH: P2.2 U3.13(CANH)
CANL: P2.3 U3.12(CANL)
CS0: R19.2 U2.13(#CS) U4.18(PD0(OC0B/SCL/INT0))
CS1: R18.2 U1.13(#CS) U4.19(PD1(SDA/INT1))
CS2: R20.2 U3.1(CS#) U4.25(PD4(ICP1/ADC8))
D6: SW2.4(PIN4) U4.27(PD7(T0/OC4D/ADC10))
D8: SW2.3(PIN3) U4.28(PB4(PCINT4/ADC11))
D9: SW2.2(PIN2) U4.29(PB5(PCINT5/OC1A/OC4B#/ADC12))
D10: SW2.1(PIN1) U4.30(PB6(PCINT6/OC1B/OC4B/ADC13))
D17: L2.1(K) U4.8(PB0(SS/PCINT0))
D30: L1.1(K) U4.22(PD5(XCK1/CTS#))
DN: R11.2 U4.3(D-)
DP: R10.2 U4.4(D+)
FLOW: P1.1 R3.1 U4.20(PD2(RXD1/INT2))
INT: U3.25(INT#) U4.1(PE6(INT.6/AIN0))
MISO: P3.1 U1.14(SDO) U2.14(SDO) U3.28(SO) U4.11(PB3(PDO/PCINT3/MISO))
MOSI: P3.4 U1.11(SDI) U2.11(SDI) U3.27(SI) U4.10(PB2(PDI/PCINT2/MOSI))
RESET: P3.5 R4.2 SW1.2 U4.13(RESET#)
SCK: P3.3 U1.12(SCLK) U2.12(SCLK) U3.26(SCK) U4.9(PB1(PCINT1/SCLK))
VUSB: D2.2(A) F1.2 U4.2(UVcc) U4.7(VBus)
$1N891: R1.2 U1.1(BIAS) U1.2(REFIN+)
$1N897: R1.1 U1.3(REFIN-) U1.4(ISENSOR)
$1N1195: R2.2 U2.1(BIAS) U2.2(REFIN+)
$1N1200: R2.1 U2.3(REFIN-) U2.4(ISENSOR)
$1N4720: C4.1 P1.4 U2.8(RTDIN-) U2.9(FORCE-)
$1N4751: C1.1 P1.5 U1.5(FORCE+) U1.7(RTDIN+)
$1N4770: C1.2 P1.6 U1.8(RTDIN-) U1.9(FORCE-)
$1N4790: C4.2 P1.3 U2.5(FORCE+) U2.7(RTDIN+)
$2N8089: U4.17(XTAL1) X1.1(OSC1)
$2N8095: U4.16(XTAL2) X1.3(OSC2)
$2N9383: C8.1 U4.42(AREF)
$2N9499: C13.2 U4.6(UCap)
$2N9903: L1.2(A) R5.1
$2N9904: L2.2(A) R6.1
$4N1497: C11.1 F1.1 P4.A4B9(VBUS) P4.B4A9(VBUS)
$4N1722: P4.A5(CC1) R8.2
$4N1785: P4.B5(CC2) R7.1
$4N2171: P4.A7(DN1) P4.B7(DN2) R11.1 R12.2
$4N2188: P4.A6(DP1) P4.B6(DP2) R10.1 R13.2
$4N5071: U3.5(RxCAN) U3.10(RXD)
$4N5075: U3.20(OSC2) X2.3(OSC2)
$4N5076: U3.21(OSC1) X2.1(OSC1)
$4N5081: U3.4(TxCAN) U3.16(TXD)
$4N5085: R9.2 U3.2(RESET#)
$4N6848: C17.1 U5.1(CB)
$4N6852: C17.2 H1.2 U5.6(SW)
$4N7229: C18.2 D1.2(A) H1.1 R16.2
$4N7245: R16.1 R17.2 U5.3(FB)
$4N7394: R14.1 R15.2 U5.4(EN)
$4N8485: D3.2(A) P2.4

Not connected (* = marked no-connect by the designer): P4 A8(SBU1)* B8(SBU2)*; U1 17(N.C)* 18(#DRDY)*; U2 17(N.C)* 18(#DRDY)*; U3 6(CLKOUT)* 7(Tx0RTS#)* 8(Tx1RTS#)* 9(Tx2RTS#)* 14(NC)* 17(NC)* 23(Rx1BF#)* 24(Rx0BF#)*; U4 12(PB7(PCINT7/OC0A/OC1C/RTS#))* 21(PD3(TXD1/INT3))* 26(PD6(T1/OC4D#/ADC9))* 31(PC6(OC3A/OC4A#))* 32(PC7(ICP3/CLK0/OC4A))* 36(PF7(ADC7/TDI))* 37(PF6(ADC6/TDO))* 38(PF5(ADC5/TMS))* 39(PF4(ADC4/TCK))* 40(PF1(ADC1))* 41(PF0(ADC0))*

## Notes on the sheets
sheet 2
- ICSP
- Connections inspired by https://learn.sparkfun.com/tutorials/qwiic-pro-micro-usb-c-atmega32u4-hookup-guide#hardware-overview
sheet 3
- USB Connector
- CAN Bus
- Power Supply
- Connectors
- VCC Auto Selector
